# Altium schematic sheet Sheet1.SchDoc
size A4
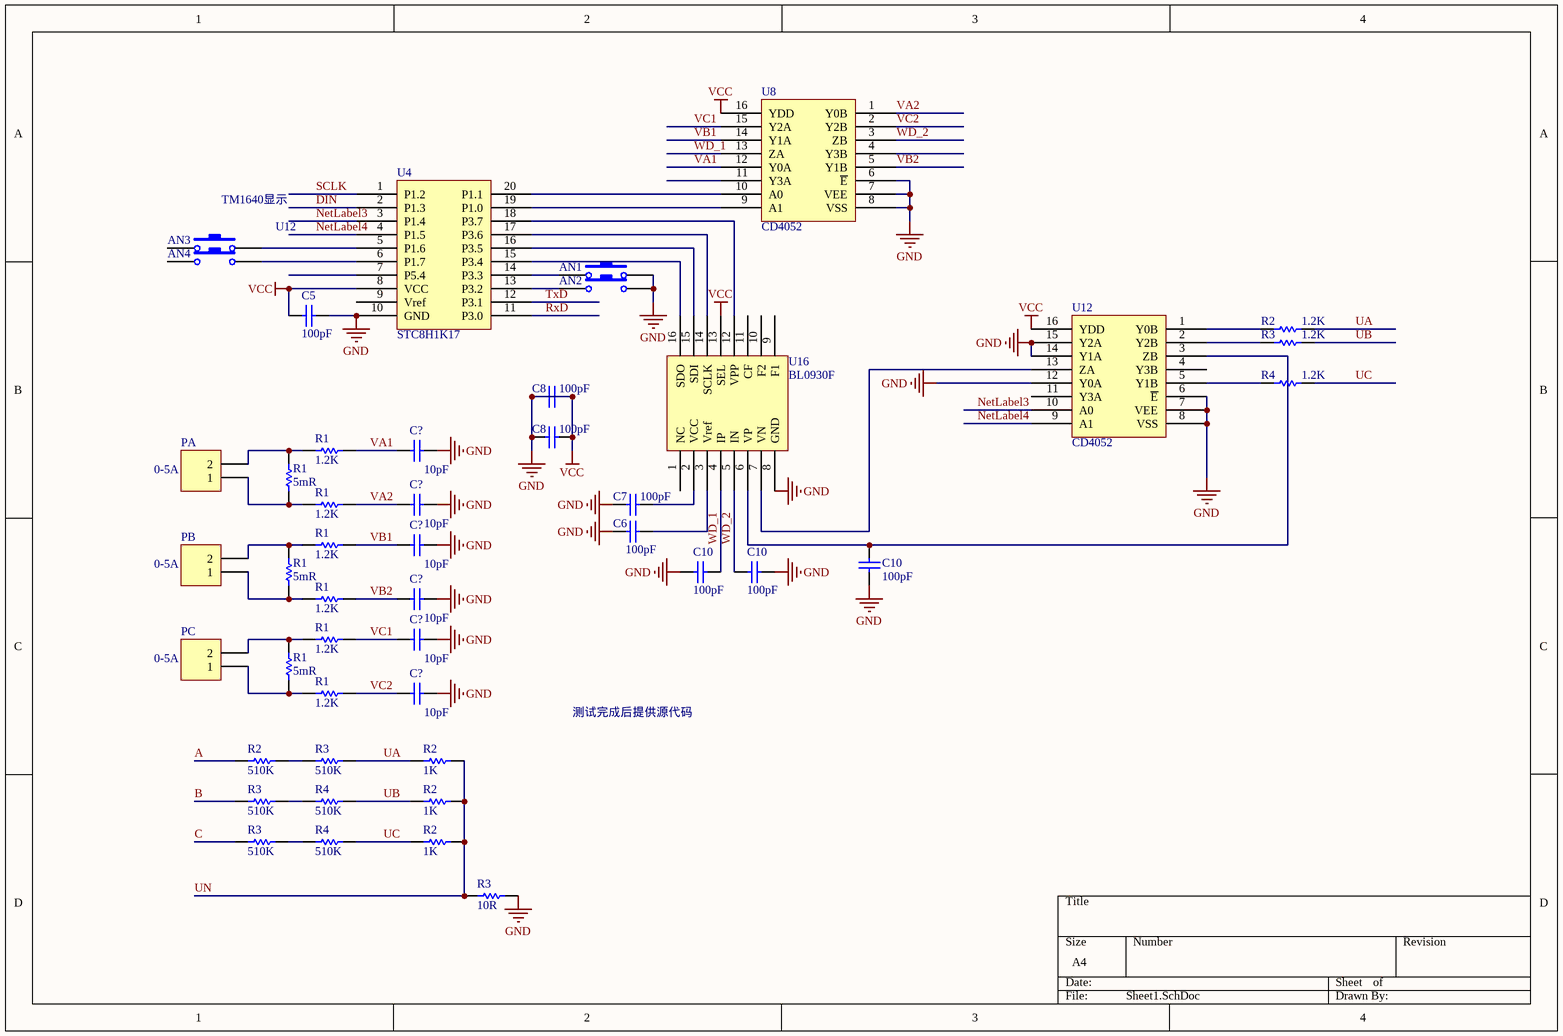
[diagram p0: Sheet1.SchDoc]

## Parts
(Parts that share a designator on the sheet are numbered #1, #2 ... from top to bottom, then left to right.)
AN1  SW-PB  [SPST-2]  (value not drawn)
AN2  SW-PB  [SPST-2]  (value not drawn)
AN3  SW-PB  [SPST-2]  (value not drawn)
AN4  SW-PB  [SPST-2]  (value not drawn)
C5  value 100pF  [RAD-0.3]  (hidden comment: Cap)
C6  value 100pF  [RAD-0.3]  (hidden comment: Cap)
C7  value 100pF  [RAD-0.3]  (hidden comment: Cap)
C8#1  value 100pF  [RAD-0.3]  (hidden comment: Cap)
C8#2  value 100pF  [RAD-0.3]  (hidden comment: Cap)
C10#1  value 100pF  [RAD-0.3]  (hidden comment: Cap)
C10#2  value 100pF  [RAD-0.3]  (hidden comment: Cap)
C10#3  value 100pF  [RAD-0.3]  (hidden comment: Cap)
C?#1  value 10pF  [RAD-0.3]  (hidden comment: Cap)
C?#2  value 10pF  [RAD-0.3]  (hidden comment: Cap)
C?#3  value 10pF  [RAD-0.3]  (hidden comment: Cap)
C?#4  value 10pF  [RAD-0.3]  (hidden comment: Cap)
C?#5  value 10pF  [RAD-0.3]  (hidden comment: Cap)
C?#6  value 10pF  [RAD-0.3]  (hidden comment: Cap)
PA  Header 2H  [HDR1X2H]  (value not drawn)
PB  Header 2H  [HDR1X2H]  (value not drawn)
PC  Header 2H  [HDR1X2H]  (value not drawn)
R1#1  value 1.2K  [AXIAL-0.3]  (hidden comment: Res1)
R1#2  value 5mR  [AXIAL-0.3]  (hidden comment: Res1)
R1#3  value 1.2K  [AXIAL-0.3]  (hidden comment: Res1)
R1#4  value 1.2K  [AXIAL-0.3]  (hidden comment: Res1)
R1#5  value 5mR  [AXIAL-0.3]  (hidden comment: Res1)
R1#6  value 1.2K  [AXIAL-0.3]  (hidden comment: Res1)
R1#7  value 1.2K  [AXIAL-0.3]  (hidden comment: Res1)
R1#8  value 5mR  [AXIAL-0.3]  (hidden comment: Res1)
R1#9  value 1.2K  [AXIAL-0.3]  (hidden comment: Res1)
R2#1  value 1.2K  [AXIAL-0.3]  (hidden comment: Res1)
R2#2  value 510K  [AXIAL-0.3]  (hidden comment: Res1)
R2#3  value 1K  [AXIAL-0.3]  (hidden comment: Res1)
R2#4  value 1K  [AXIAL-0.3]  (hidden comment: Res1)
R2#5  value 1K  [AXIAL-0.3]  (hidden comment: Res1)
R3#1  value 1.2K  [AXIAL-0.3]  (hidden comment: Res1)
R3#2  value 510K  [AXIAL-0.3]  (hidden comment: Res1)
R3#3  value 510K  [AXIAL-0.3]  (hidden comment: Res1)
R3#4  value 510K  [AXIAL-0.3]  (hidden comment: Res1)
R3#5  10R  [AXIAL-0.3]
R4#1  value 1.2K  [AXIAL-0.3]  (hidden comment: Res1)
R4#2  value 510K  [AXIAL-0.3]  (hidden comment: Res1)
R4#3  value 510K  [AXIAL-0.3]  (hidden comment: Res1)
U4  STC8H1K17
U8  CD4052
U12  CD4052
U16  BL0930F

## Nets
GND: AN1.2 AN2.2 C5.1 C5.2 C6.1 C7.1 C8#1.1 C8#1.2 C8#2.1 C8#2.2 C10#1.2 C10#2.2 C10#3.2 C?#1.2 C?#2.2 C?#3.2 C?#4.2 C?#5.2 C?#6.2 R3#5.2 U4.8(VCC) U4.10(GND) U8.6(~{E}) U8.7(VEE) U8.8(VSS) U8.16(YDD) U12.6(~{E}) U12.7(VEE) U12.8(VSS) U12.12(Y0A) U12.14(Y1A) U12.15(Y2A) U12.16(YDD) U16.8(GND) U16.13(SEL)  [also labelled VCC]
A: R2#2.1
B: R3#3.1
C: R3#4.1
DIN: U4.2(P1.3)
NetLabel3: U4.3(P1.4) U12.10(A0)
NetLabel4: U4.4(P1.5) U12.9(A1)
RxD: U4.11(P3.0)
SCLK: U4.1(P1.2)
TxD: U4.12(P3.1)
UA: R2#1.2 R2#3.1 R3#2.2
UB: R2#4.1 R3#1.2 R4#2.2
UC: R2#5.1 R4#1.2 R4#3.2
UN: R2#3.2 R2#4.2 R2#5.2 R3#5.1
VA1: C?#1.1 R1#1.2 U8.12(Y0A)
VA2: C?#2.1 R1#3.2 U8.1(Y0B)
VB1: C?#3.1 R1#4.2 U8.14(Y1A)
VB2: C?#4.1 R1#6.2 U8.5(Y1B)
VC1: C?#5.1 R1#7.2 U8.15(Y2A)
VC2: C?#6.1 R1#9.2 U8.2(Y2B)
WD_1: C10#3.1 U8.13(ZA) U16.4(IP)
WD_2: C10#1.1 U8.3(ZB) U16.5(IN)
NetAN1_1: AN1.1 U4.14(P3.3)
NetAN2_1: AN2.1 U4.13(P3.2)
NetAN3_2: AN3.2 U4.5(P1.6)
NetAN4_2: AN4.2 U4.6(P1.7)
NetC6_2: C6.2 U16.3(Vref)
NetC7_2: C7.2 U16.2(VCC)
NetC10#2_1: C10#2.1 U12.3(ZB) U16.6(VP)
NetPA_1: PA.1 R1#2.1 R1#3.1
NetPA_2: PA.2 R1#1.1 R1#2.2
NetPB_1: PB.1 R1#5.1 R1#6.1
NetPB_2: PB.2 R1#4.1 R1#5.2
NetPC_1: PC.1 R1#8.1 R1#9.1
NetPC_2: PC.2 R1#7.1 R1#8.2
NetR2#1_1: R2#1.1 U12.1(Y0B)
NetR2#2_2: R2#2.2 R3#2.1
NetR3#1_1: R3#1.1 U12.2(Y2B)
NetR3#3_2: R3#3.2 R4#2.1
NetR3#4_2: R3#4.2 R4#3.1
NetR4#1_1: R4#1.1 U12.5(Y1B)
NetU4_15: U4.15(P3.4) U16.16(SDO)
NetU4_16: U4.16(P3.5) U16.15(SDI)
NetU4_17: U4.17(P3.6) U16.14(SCLK)
NetU4_18: U4.18(P3.7) U16.12(VPP)
NetU4_19: U4.19(P1.0) U8.9(A1)
NetU4_20: U4.20(P1.1) U8.10(A0)
NetU12_13: U12.13(ZA) U16.7(VN)

Not connected (* = marked no-connect by the designer): AN3 1; AN4 1; U4 7(P5.4) 9(Vref); U8 4(Y3B) 11(Y3A); U12 4(Y3B) 11(Y3A); U16 1(NC) 9(F1) 10(F2) 11(CF)

## Notes on the sheet
- TM1640显示
- U12
- (near PA) 0-5A
- (near PB) 0-5A
- (near PC) 0-5A
- 测试完成后提供源代码

## Library data of the parts
AN1-AN4 = SW-PB: Switch; Published: 24-Mar-1999; LatestRevisionDate: 17-Jul-2002; LatestRevisionNote: Re-released for DXP Platform.; PackageReference: SPST-2; Publisher: Altium Limited; PackageDescription: Switch; 2 Leads
C5-C7 C8#1 C8#2 C10#1-C10#3 C?#1-C?#6 = Cap: Capacitor; Published: 8-Jun-2000; LatestRevisionDate: 17-Jul-2002; LatestRevisionNote: Re-released for DXP Platform.; PackageReference: RAD-0.3; Publisher: Altium Limited; PackageDescription: Radial Cap, Thru-Hole; 2 Leads; 0.3 in Pin Spacing
PA PB PC = Header 2H: Header, 2-Pin, Right Angle; LatestRevisionDate: 17-Jul-2002; LatestRevisionNote: Re-released for DXP Platform.; Publisher: Altium Limited
R1#1-R1#9 R2#1-R2#5 R3#1-R3#5 R4#1-R4#3 = Res1: Resistor; Published: 8-Jun-2000; LatestRevisionDate: 17-Jul-2002; LatestRevisionNote: Re-released for DXP Platform.; PackageReference: AXIAL-0.3; Publisher: Altium Limited; PackageDescription: Axial Device, Thru-Hole; 2 Leads; 0.3 in Pin Spacing
  R3#5: Value: 10R
U4 = Component_2
U8 U12 = Component_3
U16 = Component_1